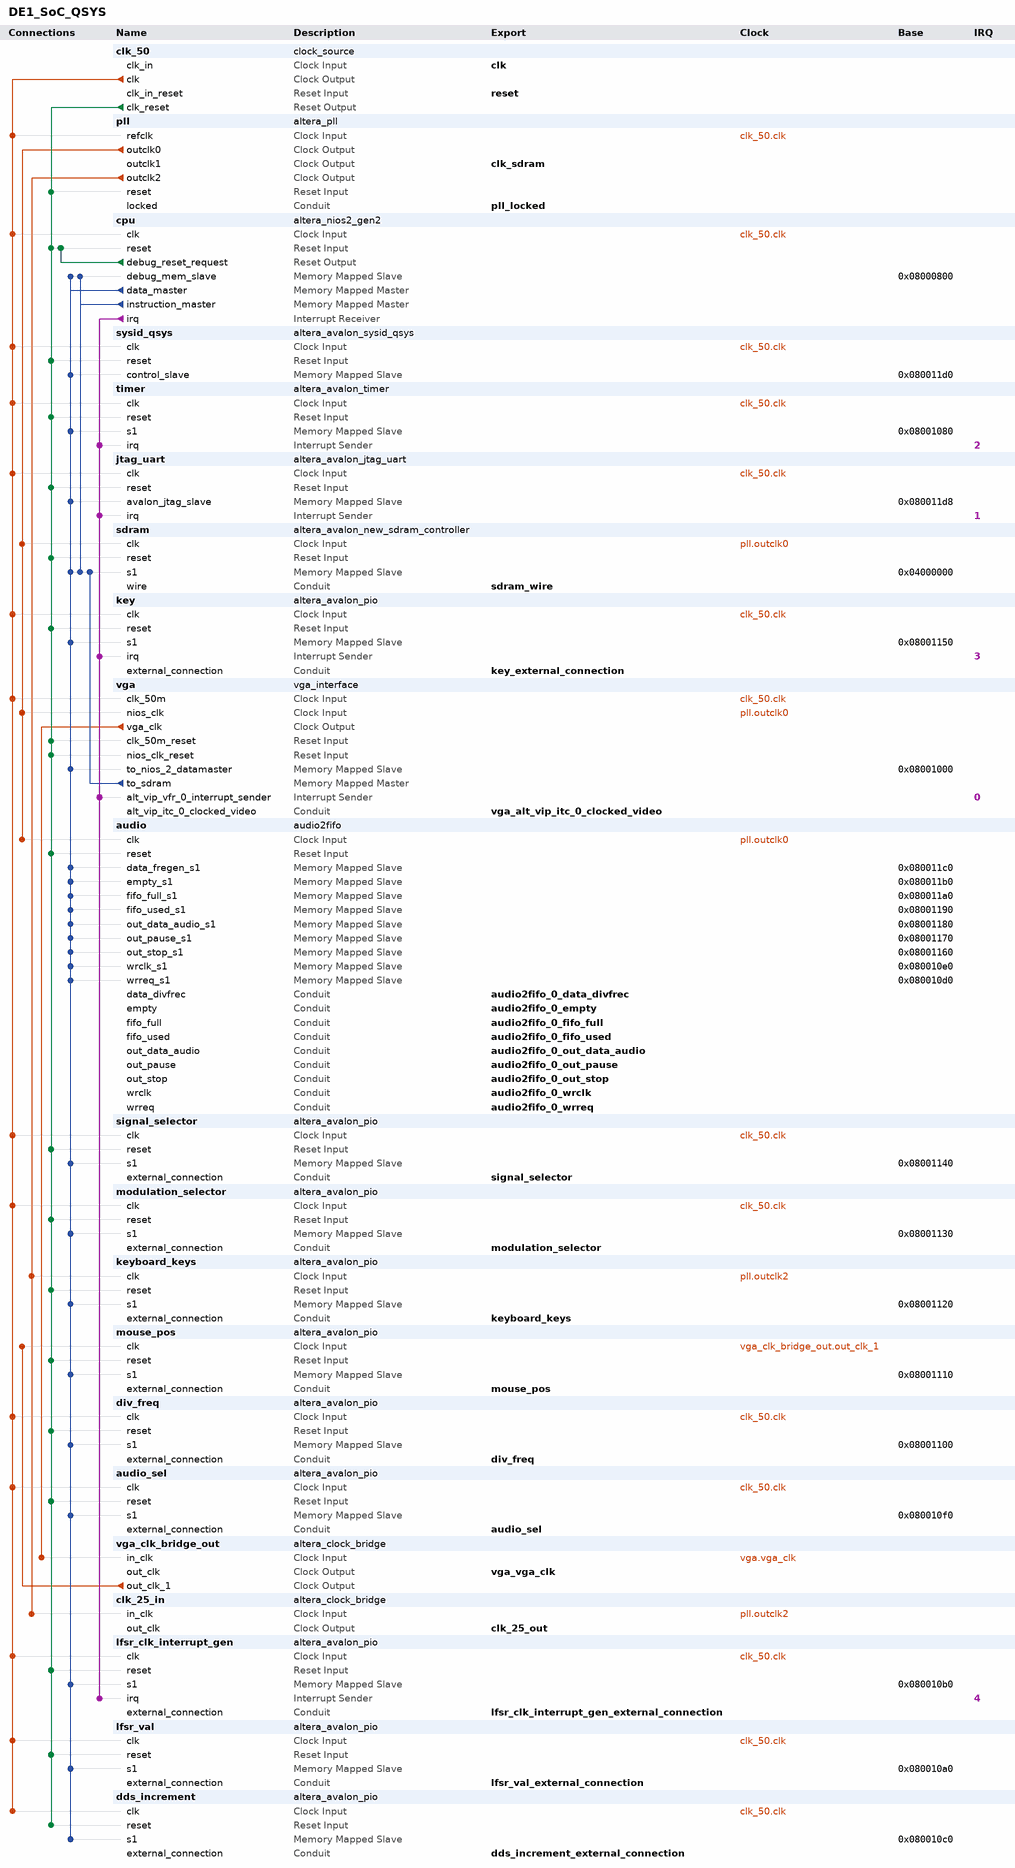
[diagram p0: system contents]
# Platform Designer (Qsys) system DE1_SoC_QSYS, Cyclone V 5CSEMA5F31C6
# Parameters at their usual value, and those the tool derives, are not listed.
package require -exact qsys 16.1
create_system DE1_SoC_QSYS
set_project_property DEVICE_FAMILY {Cyclone V}
set_project_property DEVICE 5CSEMA5F31C6

add_instance clk_50 clock_source 16.1
set_instance_parameter_value clk_50 clockFrequency 50000000

add_instance pll altera_pll 16.1
set_instance_parameter_value pll gui_device_speed_grade 2
set_instance_parameter_value pll gui_number_of_clocks 3
set_instance_parameter_value pll gui_operation_mode normal
set_instance_parameter_value pll gui_output_clock_frequency0 142.857142
set_instance_parameter_value pll gui_output_clock_frequency1 142.857142
set_instance_parameter_value pll gui_output_clock_frequency2 25.0
set_instance_parameter_value pll gui_phase_shift1 -3800
set_instance_parameter_value pll gui_phase_shift_deg1 -90.0
set_instance_parameter_value pll gui_pll_mode {Integer-N PLL}
set_instance_parameter_value pll gui_reference_clock_frequency 50.0
set_instance_parameter_value pll gui_use_locked true

add_instance cpu altera_nios2_gen2 16.1
set_instance_parameter_value cpu dcache_size 2048
set_instance_parameter_value cpu exceptionOffset 5760032
set_instance_parameter_value cpu exceptionSlave sdram.s1
set_instance_parameter_value cpu icache_size 4096
set_instance_parameter_value cpu impl Fast
set_instance_parameter_value cpu resetSlave sdram.s1
set_instance_parameter_value cpu setting_activateTrace true

add_instance sysid_qsys altera_avalon_sysid_qsys 16.1
set_instance_parameter_value sysid_qsys id 0

add_instance timer altera_avalon_timer 16.1
set_instance_parameter_value timer period 1
set_instance_parameter_value timer periodUnits MSEC

add_instance jtag_uart altera_avalon_jtag_uart 16.1
set_instance_parameter_value jtag_uart simInteractiveOptions NO_INTERACTIVE_WINDOWS

add_instance sdram altera_avalon_new_sdram_controller 16.1
set_instance_parameter_value sdram TAC 5.4
set_instance_parameter_value sdram TRCD 15.0
set_instance_parameter_value sdram TRP 15.0
set_instance_parameter_value sdram casLatency 3
set_instance_parameter_value sdram columnWidth 10
set_instance_parameter_value sdram dataWidth 16
set_instance_parameter_value sdram generateSimulationModel true
set_instance_parameter_value sdram model single_Micron_MT48LC4M32B2_7_chip
set_instance_parameter_value sdram numberOfBanks 4
set_instance_parameter_value sdram numberOfChipSelects 1
set_instance_parameter_value sdram powerUpDelay 100.0
set_instance_parameter_value sdram refreshPeriod 7.8125
set_instance_parameter_value sdram rowWidth 13

add_instance key altera_avalon_pio 16.1
set_instance_parameter_value key captureEdge true
set_instance_parameter_value key direction Input
set_instance_parameter_value key edgeType FALLING
set_instance_parameter_value key generateIRQ true
set_instance_parameter_value key irqType EDGE
set_instance_parameter_value key simDoTestBenchWiring true
set_instance_parameter_value key simDrivenValue 15
set_instance_parameter_value key width 4

add_instance vga vga_interface 1.0

add_instance audio audio2fifo 1.0

add_instance signal_selector altera_avalon_pio 16.1
set_instance_parameter_value signal_selector direction Output
set_instance_parameter_value signal_selector width 8

add_instance modulation_selector altera_avalon_pio 16.1
set_instance_parameter_value modulation_selector direction Output
set_instance_parameter_value modulation_selector width 4

add_instance keyboard_keys altera_avalon_pio 16.1
set_instance_parameter_value keyboard_keys direction Input
set_instance_parameter_value keyboard_keys width 32

add_instance mouse_pos altera_avalon_pio 16.1
set_instance_parameter_value mouse_pos direction Input
set_instance_parameter_value mouse_pos width 32

add_instance div_freq altera_avalon_pio 16.1
set_instance_parameter_value div_freq direction Output
set_instance_parameter_value div_freq width 32

add_instance audio_sel altera_avalon_pio 16.1
set_instance_parameter_value audio_sel direction Output
set_instance_parameter_value audio_sel width 1

add_instance vga_clk_bridge_out altera_clock_bridge 16.1
set_instance_parameter_value vga_clk_bridge_out DERIVED_CLOCK_RATE 40000000
set_instance_parameter_value vga_clk_bridge_out EXPLICIT_CLOCK_RATE 0
set_instance_parameter_value vga_clk_bridge_out NUM_CLOCK_OUTPUTS 2

add_instance clk_25_in altera_clock_bridge 16.1
set_instance_parameter_value clk_25_in DERIVED_CLOCK_RATE 25000000
set_instance_parameter_value clk_25_in EXPLICIT_CLOCK_RATE 25000000

add_instance lfsr_clk_interrupt_gen altera_avalon_pio 16.1
set_instance_parameter_value lfsr_clk_interrupt_gen captureEdge true
set_instance_parameter_value lfsr_clk_interrupt_gen direction Input
set_instance_parameter_value lfsr_clk_interrupt_gen generateIRQ true
set_instance_parameter_value lfsr_clk_interrupt_gen irqType EDGE
set_instance_parameter_value lfsr_clk_interrupt_gen width 1

add_instance lfsr_val altera_avalon_pio 16.1
set_instance_parameter_value lfsr_val direction Input
set_instance_parameter_value lfsr_val width 32

add_instance dds_increment altera_avalon_pio 16.1
set_instance_parameter_value dds_increment direction Output
set_instance_parameter_value dds_increment width 32

# connections
add_connection clk_50.clk audio_sel.clk clock
add_connection clk_50.clk cpu.clk clock
add_connection clk_50.clk dds_increment.clk clock
add_connection clk_50.clk div_freq.clk clock
add_connection clk_50.clk jtag_uart.clk clock
add_connection clk_50.clk key.clk clock
add_connection clk_50.clk lfsr_clk_interrupt_gen.clk clock
add_connection clk_50.clk lfsr_val.clk clock
add_connection clk_50.clk modulation_selector.clk clock
add_connection clk_50.clk pll.refclk clock
add_connection clk_50.clk signal_selector.clk clock
add_connection clk_50.clk sysid_qsys.clk clock
add_connection clk_50.clk timer.clk clock
add_connection clk_50.clk vga.clk_50m clock
add_connection pll.outclk0 audio.clk clock
add_connection pll.outclk0 sdram.clk clock
add_connection pll.outclk0 vga.nios_clk clock
add_connection pll.outclk2 clk_25_in.in_clk clock
add_connection pll.outclk2 keyboard_keys.clk clock
add_connection vga.vga_clk vga_clk_bridge_out.in_clk clock
add_connection vga_clk_bridge_out.out_clk_1 mouse_pos.clk clock
add_connection clk_50.clk_reset audio.reset reset
add_connection clk_50.clk_reset audio_sel.reset reset
add_connection clk_50.clk_reset cpu.reset reset
add_connection clk_50.clk_reset dds_increment.reset reset
add_connection clk_50.clk_reset div_freq.reset reset
add_connection clk_50.clk_reset jtag_uart.reset reset
add_connection clk_50.clk_reset key.reset reset
add_connection clk_50.clk_reset keyboard_keys.reset reset
add_connection clk_50.clk_reset lfsr_clk_interrupt_gen.reset reset
add_connection clk_50.clk_reset lfsr_val.reset reset
add_connection clk_50.clk_reset modulation_selector.reset reset
add_connection clk_50.clk_reset mouse_pos.reset reset
add_connection clk_50.clk_reset pll.reset reset
add_connection clk_50.clk_reset sdram.reset reset
add_connection clk_50.clk_reset signal_selector.reset reset
add_connection clk_50.clk_reset sysid_qsys.reset reset
add_connection clk_50.clk_reset timer.reset reset
add_connection clk_50.clk_reset vga.clk_50m_reset reset
add_connection clk_50.clk_reset vga.nios_clk_reset reset
add_connection cpu.debug_reset_request cpu.reset reset
add_connection cpu.data_master audio.data_fregen_s1 avalon
set_connection_parameter_value cpu.data_master/audio.data_fregen_s1 baseAddress 0x080011c0
add_connection cpu.data_master audio.empty_s1 avalon
set_connection_parameter_value cpu.data_master/audio.empty_s1 baseAddress 0x080011b0
add_connection cpu.data_master audio.fifo_full_s1 avalon
set_connection_parameter_value cpu.data_master/audio.fifo_full_s1 baseAddress 0x080011a0
add_connection cpu.data_master audio.fifo_used_s1 avalon
set_connection_parameter_value cpu.data_master/audio.fifo_used_s1 baseAddress 0x08001190
add_connection cpu.data_master audio.out_data_audio_s1 avalon
set_connection_parameter_value cpu.data_master/audio.out_data_audio_s1 baseAddress 0x08001180
add_connection cpu.data_master audio.out_pause_s1 avalon
set_connection_parameter_value cpu.data_master/audio.out_pause_s1 baseAddress 0x08001170
add_connection cpu.data_master audio.out_stop_s1 avalon
set_connection_parameter_value cpu.data_master/audio.out_stop_s1 baseAddress 0x08001160
add_connection cpu.data_master audio.wrclk_s1 avalon
set_connection_parameter_value cpu.data_master/audio.wrclk_s1 baseAddress 0x080010e0
add_connection cpu.data_master audio.wrreq_s1 avalon
set_connection_parameter_value cpu.data_master/audio.wrreq_s1 baseAddress 0x080010d0
add_connection cpu.data_master audio_sel.s1 avalon
set_connection_parameter_value cpu.data_master/audio_sel.s1 baseAddress 0x080010f0
add_connection cpu.data_master cpu.debug_mem_slave avalon
set_connection_parameter_value cpu.data_master/cpu.debug_mem_slave baseAddress 0x08000800
add_connection cpu.data_master dds_increment.s1 avalon
set_connection_parameter_value cpu.data_master/dds_increment.s1 baseAddress 0x080010c0
add_connection cpu.data_master div_freq.s1 avalon
set_connection_parameter_value cpu.data_master/div_freq.s1 baseAddress 0x08001100
add_connection cpu.data_master jtag_uart.avalon_jtag_slave avalon
set_connection_parameter_value cpu.data_master/jtag_uart.avalon_jtag_slave baseAddress 0x080011d8
add_connection cpu.data_master key.s1 avalon
set_connection_parameter_value cpu.data_master/key.s1 baseAddress 0x08001150
add_connection cpu.data_master keyboard_keys.s1 avalon
set_connection_parameter_value cpu.data_master/keyboard_keys.s1 baseAddress 0x08001120
add_connection cpu.data_master lfsr_clk_interrupt_gen.s1 avalon
set_connection_parameter_value cpu.data_master/lfsr_clk_interrupt_gen.s1 baseAddress 0x080010b0
add_connection cpu.data_master lfsr_val.s1 avalon
set_connection_parameter_value cpu.data_master/lfsr_val.s1 baseAddress 0x080010a0
add_connection cpu.data_master modulation_selector.s1 avalon
set_connection_parameter_value cpu.data_master/modulation_selector.s1 baseAddress 0x08001130
add_connection cpu.data_master mouse_pos.s1 avalon
set_connection_parameter_value cpu.data_master/mouse_pos.s1 baseAddress 0x08001110
add_connection cpu.data_master sdram.s1 avalon
set_connection_parameter_value cpu.data_master/sdram.s1 baseAddress 0x04000000
add_connection cpu.data_master signal_selector.s1 avalon
set_connection_parameter_value cpu.data_master/signal_selector.s1 baseAddress 0x08001140
add_connection cpu.data_master sysid_qsys.control_slave avalon
set_connection_parameter_value cpu.data_master/sysid_qsys.control_slave baseAddress 0x080011d0
add_connection cpu.data_master timer.s1 avalon
set_connection_parameter_value cpu.data_master/timer.s1 baseAddress 0x08001080
add_connection cpu.data_master vga.to_nios_2_datamaster avalon
set_connection_parameter_value cpu.data_master/vga.to_nios_2_datamaster baseAddress 0x08001000
add_connection cpu.instruction_master cpu.debug_mem_slave avalon
set_connection_parameter_value cpu.instruction_master/cpu.debug_mem_slave baseAddress 0x08000800
add_connection cpu.instruction_master sdram.s1 avalon
set_connection_parameter_value cpu.instruction_master/sdram.s1 baseAddress 0x04000000
add_connection vga.to_sdram sdram.s1 avalon
set_connection_parameter_value vga.to_sdram/sdram.s1 baseAddress 0x04000000
add_connection cpu.irq jtag_uart.irq interrupt
set_connection_parameter_value cpu.irq/jtag_uart.irq irqNumber 1
add_connection cpu.irq key.irq interrupt
set_connection_parameter_value cpu.irq/key.irq irqNumber 3
add_connection cpu.irq lfsr_clk_interrupt_gen.irq interrupt
set_connection_parameter_value cpu.irq/lfsr_clk_interrupt_gen.irq irqNumber 4
add_connection cpu.irq timer.irq interrupt
set_connection_parameter_value cpu.irq/timer.irq irqNumber 2
add_connection cpu.irq vga.alt_vip_vfr_0_interrupt_sender interrupt
set_connection_parameter_value cpu.irq/vga.alt_vip_vfr_0_interrupt_sender irqNumber 0

# exported interfaces
add_interface audio2fifo_0_data_divfrec conduit end
set_interface_property audio2fifo_0_data_divfrec EXPORT_OF audio.data_divfrec
add_interface audio2fifo_0_empty conduit end
set_interface_property audio2fifo_0_empty EXPORT_OF audio.empty
add_interface audio2fifo_0_fifo_full conduit end
set_interface_property audio2fifo_0_fifo_full EXPORT_OF audio.fifo_full
add_interface audio2fifo_0_fifo_used conduit end
set_interface_property audio2fifo_0_fifo_used EXPORT_OF audio.fifo_used
add_interface audio2fifo_0_out_data_audio conduit end
set_interface_property audio2fifo_0_out_data_audio EXPORT_OF audio.out_data_audio
add_interface audio2fifo_0_out_pause conduit end
set_interface_property audio2fifo_0_out_pause EXPORT_OF audio.out_pause
add_interface audio2fifo_0_out_stop conduit end
set_interface_property audio2fifo_0_out_stop EXPORT_OF audio.out_stop
add_interface audio2fifo_0_wrclk conduit end
set_interface_property audio2fifo_0_wrclk EXPORT_OF audio.wrclk
add_interface audio2fifo_0_wrreq conduit end
set_interface_property audio2fifo_0_wrreq EXPORT_OF audio.wrreq
add_interface audio_sel conduit end
set_interface_property audio_sel EXPORT_OF audio_sel.external_connection
add_interface clk clock sink
set_interface_property clk EXPORT_OF clk_50.clk_in
add_interface clk_25_out clock source
set_interface_property clk_25_out EXPORT_OF clk_25_in.out_clk
add_interface clk_sdram clock source
set_interface_property clk_sdram EXPORT_OF pll.outclk1
add_interface dds_increment_external_connection conduit end
set_interface_property dds_increment_external_connection EXPORT_OF dds_increment.external_connection
add_interface div_freq conduit end
set_interface_property div_freq EXPORT_OF div_freq.external_connection
add_interface key_external_connection conduit end
set_interface_property key_external_connection EXPORT_OF key.external_connection
add_interface keyboard_keys conduit end
set_interface_property keyboard_keys EXPORT_OF keyboard_keys.external_connection
add_interface lfsr_clk_interrupt_gen_external_connection conduit end
set_interface_property lfsr_clk_interrupt_gen_external_connection EXPORT_OF lfsr_clk_interrupt_gen.external_connection
add_interface lfsr_val_external_connection conduit end
set_interface_property lfsr_val_external_connection EXPORT_OF lfsr_val.external_connection
add_interface modulation_selector conduit end
set_interface_property modulation_selector EXPORT_OF modulation_selector.external_connection
add_interface mouse_pos conduit end
set_interface_property mouse_pos EXPORT_OF mouse_pos.external_connection
add_interface pll_locked conduit end
set_interface_property pll_locked EXPORT_OF pll.locked
add_interface reset reset sink
set_interface_property reset EXPORT_OF clk_50.clk_in_reset
add_interface sdram_wire conduit end
set_interface_property sdram_wire EXPORT_OF sdram.wire
add_interface signal_selector conduit end
set_interface_property signal_selector EXPORT_OF signal_selector.external_connection
add_interface vga_alt_vip_itc_0_clocked_video conduit end
set_interface_property vga_alt_vip_itc_0_clocked_video EXPORT_OF vga.alt_vip_itc_0_clocked_video
add_interface vga_vga_clk clock source
set_interface_property vga_vga_clk EXPORT_OF vga_clk_bridge_out.out_clk

set_interconnect_requirement {$system} qsys_mm.clockCrossingAdapter AUTO
set_interconnect_requirement {$system} qsys_mm.maxAdditionalLatency 2

save_system DE1_SoC_QSYS.qsys
